# EAGLE design pwr_block (EAGLE 6.5.0)
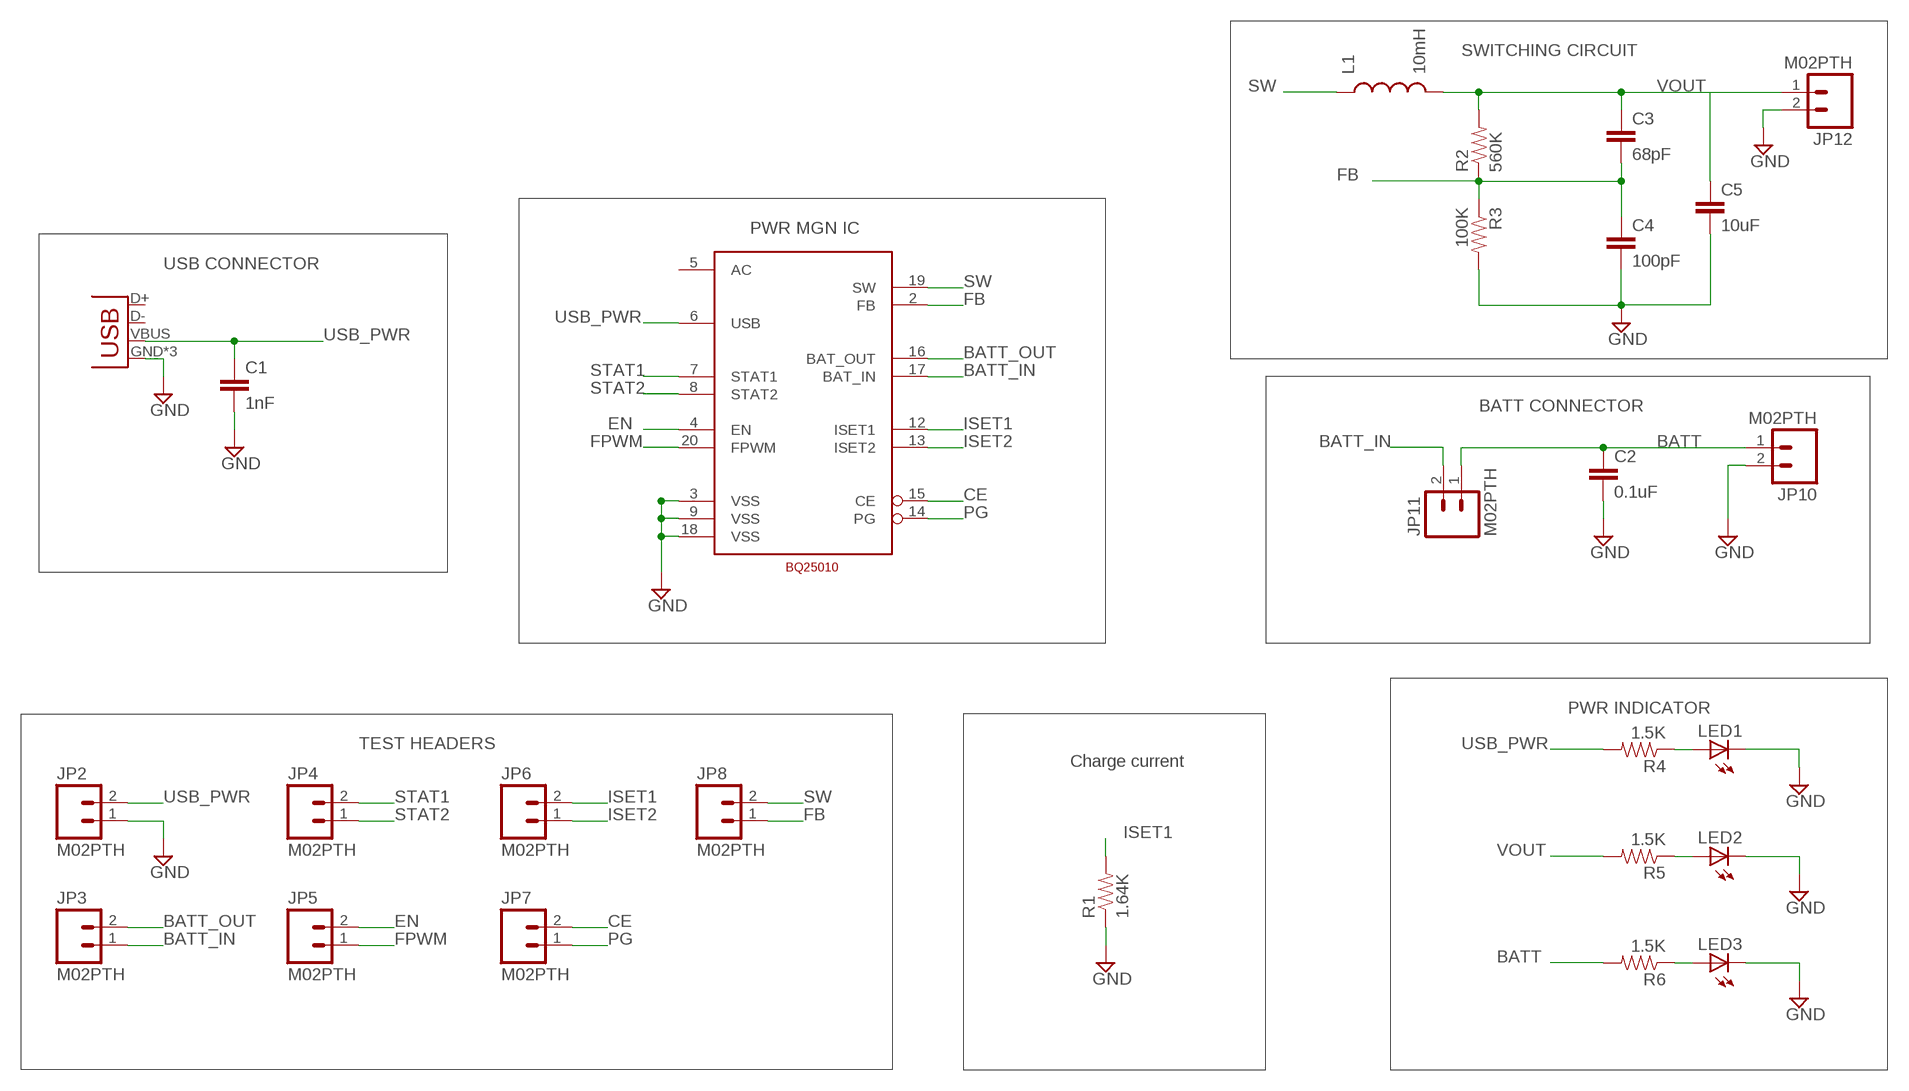
[diagram p0: schematic, sheet 1]

## Parts
C1  1nF  1NF/1000PF-50V-10%(0603)  [0603-CAP]
C2  0.1uF  0.1UF-100V-10%(0603)  [0603-CAP]
C3  68pF  10UF-6.3V-20%(0603)  [0603-CAP]
C4  100pF  10UF-6.3V-20%(0603)  [0603-CAP]
C5  10uF  10UF-6.3V-20%(0603)  [0603-CAP]
JP1  USB-MICROB  [USB-MICROB]
JP2  M02PTH  [1X02]
JP3  M02PTH  [1X02]
JP4  M02PTH  [1X02]
JP5  M02PTH  [1X02]
JP6  M02PTH  [1X02]
JP7  M02PTH  [1X02]
JP8  M02PTH  [1X02]
JP10  M02PTH  [1X02]
JP11  M02PTH  [1X02]
JP12  M02PTH  [1X02]
L1  10mH  INDUCTOR0603  [0603]
LED1  LED0603  [LED-0603]
LED2  LED0603  [LED-0603]
LED3  LED0603  [LED-0603]
R1  1.64K  RESISTOR0603-RES  [0603-RES]
R2  560K  RESISTOR0603-RES  [0603-RES]
R3  100K  RESISTOR0603-RES  [0603-RES]
R4  1.5K  RESISTOR0603-RES  [0603-RES]
R5  1.5K  RESISTOR0603-RES  [0603-RES]
R6  1.5K  RESISTOR0603-RES  [0603-RES]
U$1  BQ25010  [VQFN_RHL_20PIN]

## Nets
BATT: C2.1 JP10.1 JP11.1 R6.2
BATT_IN: JP3.1 JP11.2 U$1.17(BAT_IN)
BATT_OUT: JP3.2 U$1.16(BAT_OUT)
CE: JP7.2 U$1.15(CE)
EN: JP5.2 U$1.4(EN)
FB: C3.2 C4.1 JP8.1 R2.1 R3.1 U$1.2(FB)
FPWM: JP5.1 U$1.20(FPWM)
GND: C1.2 C2.2 C4.2 C5.2 JP1.GND JP1.MT1(GND) JP1.MT2(GND) JP2.1 JP10.2 JP12.2 LED1.C LED2.C LED3.C R1.1 R3.2 U$1.3(VSS) U$1.9(VSS) U$1.18(VSS)
ISET1: JP6.2 R1.2 U$1.12(ISET1)
ISET2: JP6.1 U$1.13(ISET2)
N$1: LED1.A R4.1
N$2: LED2.A R5.1
N$3: LED3.A R6.1
PG: JP7.1 U$1.14(PG)
STAT1: JP4.2 U$1.7(STAT1)
STAT2: JP4.1 U$1.8(STAT2)
SW: JP8.2 L1.1 U$1.19(SW)
USB_PWR: C1.1 JP1.VBUS JP2.2 R4.2 U$1.6(USB)
VOUT: C3.1 C5.1 JP12.1 L1.2 R2.2 R5.2
Unconnected: JP1.D+ JP1.D- U$1.5(AC)

## Notes on the sheet
- SWITCHING CIRCUIT
- PWR MGN IC
- USB CONNECTOR
- BATT CONNECTOR
- PWR INDICATOR
- TEST HEADERS
- Charge current

## Library data of the parts
C1 = SparkFun-Capacitors:1NF/1000PF-50V-10%(0603): CAP-07886; PROD_ID: CAP-07886
C2 = SparkFun-Capacitors:0.1UF-100V-10%(0603): CAP-08390; PROD_ID: CAP-08390
C3 C4 = SparkFun-Capacitors:10UF-6.3V-20%(0603): CAP-11015; PROD_ID: CAP-11015; VALUE: 10uF
C5 = SparkFun-Capacitors:10UF-6.3V-20%(0603): CAP-11015; PROD_ID: CAP-11015
JP1 = SparkFun-Connectors:USB: USB Connectors USB-B-PTH is fully proven SKU : PRT-00139/CONN-08278 USB-miniB is fully proven SKU : PRT-00587 USB-A-PCB is untested. USB-A-H is throughly reviewed, but untested. Spark Fun Electronics SKU : PRT-00437 USB-B-SMT is throughly reviewed, but untested. Needs silkscreen touching up. USB-A-S has not been used/tested USB-MB-H has not been used/tested USB-MICROB has been used. CONN-09505; DESCRIPTION: CONN RCPT STD MICRO USB TYPE B; PROD_ID: CONN-09505
JP2-JP8 JP10-JP12 = SparkFun-Connectors:M02: Standard 2-pin 0.1" header. Use with - straight break away headers ( PRT-00116) - right angle break away headers (PRT-00553) - swiss pins (PRT-00743) - machine pins (PRT-00117) - female headers (PRT-00115) Molex polarized connector foot print use with: PRT-08233 with associated crimp pins and housings. 2.54_SCREWTERM for use with PRT-10571. 3.5mm Screw Terminal footprints for PRT-08084 5mm Screw Terminal footprints for use with PRT-08433
L1 = SparkFun-Passives:INDUCTOR: Inductors Basic Inductor/Choke - 0603 and 1206. Footprints are not proven and vary greatly between part numbers. SRN6045- 33uH, 20% 1.4A SDR0403-560KL - 56uH, 10%, 500mA RMS/740mA peak
LED1-LED3 = SparkFun-LED:LED: LEDs Standard schematic elements and footprints for 5mm, 3mm, 1206, and 0603 sized LEDs. 5mm - Spark Fun Electronics SKU : COM-00529 (and others)
R1-R6 = SparkFun-Passives:RESISTOR: Resistor Basic schematic elements and footprints for 0603, 1206, and PTH resistors.
U$1 = TuansLib:BQ25010

## Board
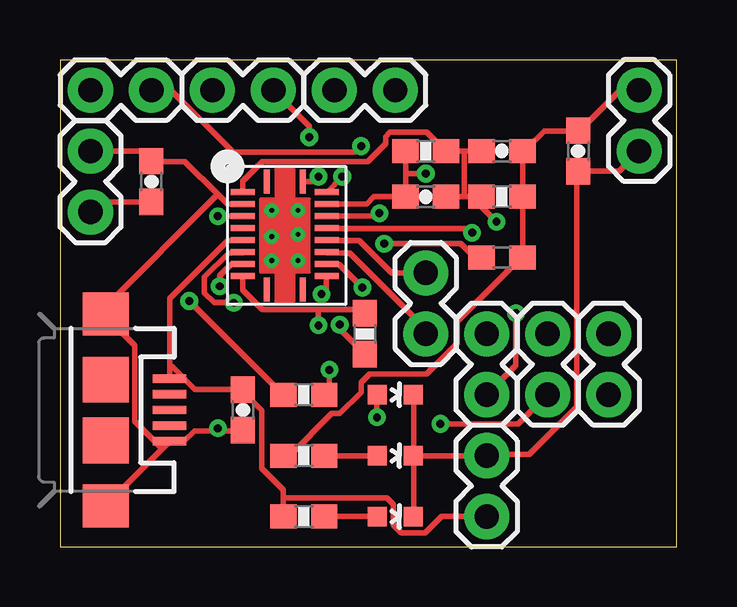
[diagram p1: board, top side]
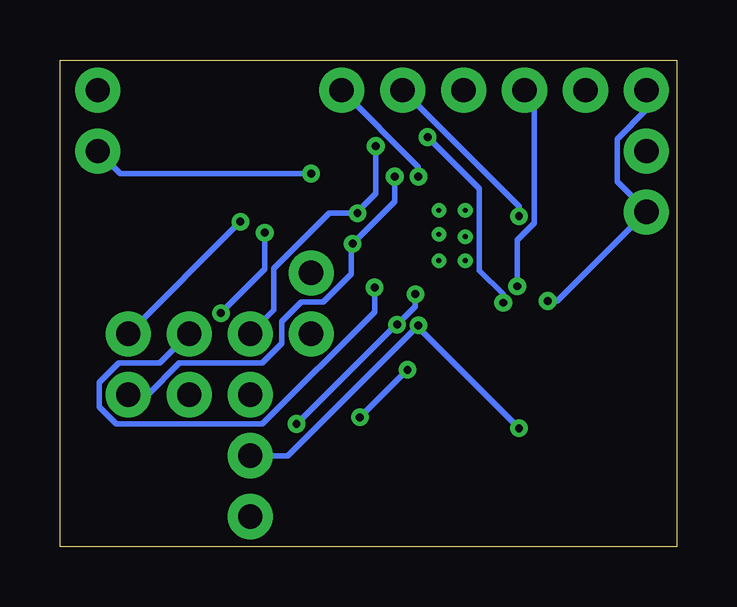
[diagram p2: board, bottom side, seen from below]

Size 25.7 x 20.31 mm. Coordinates in mm from the lower left corner, seen from the top.
Outline: 0,0 25.7,0 25.7,20.31 0,20.31 0,0
Copper layers (1*16): Top 0.035mm / dielectric 1.5mm / Bottom 0.035mm
Design rules "default *": minimum track width 9mil, minimum drill 13mil, track to track 6mil, track to pad 6mil, pad to pad 6mil, via to via 6mil, smd to smd 6mil, copper to edge 15mil, drill to drill 15mil, minimum pad ring 8mil, minimum via ring 8mil, stop-mask expansion 3mil, vias tented up to drill 0mil, thermal gap 10mil

### Footprints (pad centres in the part's own frame; a part is rotated, then mirrored left to right if it is on the bottom)
0603-CAP = smd 1.1 x 1: 1 -0.85,0; 2 0.85,0
USB-MICROB = smd 0.35 x 1.4: D+ 0,2.65; D- -0.65,2.65; GND 1.3,2.65; ID 0.65,2.65; VBUS -1.3,2.65 | smd 1.8 x 1.9: MT1 -4,0; MT2 4,0 | smd 1.9 x 1.9: P$1 -1.27,0; P$2 1.27,0
1X02 = drill 1.016 pad 1.88: 1 0,0; 2 2.54,0
0603 = smd 1.1 x 1: 1 -0.85,0; 2 0.85,0
LED-0603 = smd 0.8 x 0.8: A 0,-0.75; C 0,0.75
0603-RES = smd 1.1 x 1: 1 -0.85,0; 2 0.85,0
VQFN_RHL_20PIN = smd 1 x 0.25: 1 0,1; 10 4.5,1; 11 4.5,2.5; 20 0,2.5 | smd 0.25 x 1: 2 0.45,0; 3 0.95,0; 4 1.45,0; 5 1.95,0; 6 2.45,0; 7 2.95,0; 8 3.45,0; 9 3.95,0; 12 3.95,3.5; 13 3.45,3.5; 14 2.95,3.5; 15 2.45,3.5; 16 1.95,3.5; 17 1.45,3.5; 18 0.95,3.5; 19 0.45,3.5 | drill 0.2: P$21 1.2,2.3; P$22 1.2,1.2; P$23 2.3,1.2; P$24 2.2,2.3; P$25 3.3,2.3; P$26 3.3,1.2

### Placement (x,y rotation side)
C1  7.62,5.71 270 top
C2  3.81,15.24 90 top
C3  18.41,16.51 180 top
C4  15.24,14.61 180 top
C5  21.59,16.51 270 top
JP1  1.91,5.71 270 top
JP2  17.78,3.81 270 top
JP3  17.78,8.89 270 top
JP4  6.35,19.05 0 top
JP5  13.97,19.05 180 top
JP6  20.32,8.89 270 top
JP7  15.24,8.89 90 top
JP8  22.86,8.89 270 top
JP10  1.27,13.97 90 top
JP11  1.27,19.05 0 top
JP12  24.13,19.05 270 top
L1  18.41,12.06 0 top
LED1  13.97,1.27 270 top
LED2  13.97,3.81 270 top
LED3  13.97,6.35 270 top
R1  12.7,8.89 270 top
R2  18.41,14.61 0 top
R3  15.24,16.51 180 top
R4  10.16,1.27 180 top
R5  10.16,3.81 180 top
R6  10.16,6.35 180 top
U$1  7.62,15.24 270 top

### Tracks (layer width: path | path; a pad name or v marks a point on that pad's centre or on a via)
BATT  (via drill 0.33)
  Top 0.229: JP10.1 1.68,14.38 3.81,14.38 C2.1 | v5.38,10.26 9.3,6.35 R6.2
  Bottom 0.229: v5.38,10.26 4.98,10.26 JP10.1 1.32,14.07 2.49,15.24 2.49,17.02 1.27,18.24 JP11.1
BATT_IN  (via drill 0.33)
  Top 0.229: v13.31,13.92 13.18,13.79 U$1.17 | JP11.2 4.62,19.05 7.21,16.46 12.29,16.46 v12.55,16.71
  Bottom 0.229: JP3.1 16.79,9.88 16.79,11.61 14.48,13.92 v13.31,13.92 13.26,14.02 12.55,14.73 v12.55,16.71
BATT_OUT  (via drill 0.33)
  Top 0.229: v17.17,13.11 16.99,13.28 U$1.16 | v19,9.75 19,7.57 JP3.2
  Bottom 0.229: v17.17,13.11 17.17,11.58 v19,9.75
CE
  Top 0.229: JP7.2 13.82,11.43 12.47,12.78 11.12,12.78 U$1.15
EN  (via drill 0.33)
  Top 0.229: v6.58,13.79 U$1.4
  Bottom 0.229: v6.58,13.79 6.58,14.2 JP5.2
FB  (via drill 0.33)
  Top 0.229: 16.84,14.61 R2.1 17.25,14.5 v18.19,13.56 | 16.84,14.61 C4.1 | U$1.2 7.62,15.27 8.43,16.08 12.83,16.08 13.56,16.82 13.56,17.12 13.74,17.3 15.29,17.3 16.08,16.51 R3.1 16.84,16.51 | 16.84,16.51 C3.2 | 16.84,16.51 16.84,14.61
  Bottom 0.229: v18.19,13.56 JP8.1
FPWM  (via drill 0.33)
  Top 0.229: U$1.20 10.57,15.24 v10.77,15.44
  Bottom 0.229: v10.77,15.44 10.77,15.85 JP5.1
GND  (via drill 0.33)
  Top 0.229: 6.58,4.85 5.61,4.85 5.18,4.42 4.57,4.42 JP1.GND 4.5,4.32 4.27,4.09 | 6.58,4.85 7.62,4.85 C1.2 | 4.27,4.09 1.91,1.73 JP1.MT2 | 6.58,14.71 5.21,16.08 3.81,16.08 C2.2 3.71,16.13 3.33,16.51 JP10.2 | 6.58,14.71 6.99,14.3 U$1.3 | 6.58,14.71 1.91,10.03 JP1.MT1 1.93,9.6 3.12,8.41 3.12,5.23 4.27,4.09 | U$1.18 12.78,14.3 13.08,14.61 C4.2 14.4,14.71 14.4,15.57 | 14.4,15.57 14.4,16.51 R3.2 | JP12.2 23.29,15.67 21.59,15.67 C5.2 21.54,15.57 21.54,5.84 19.56,3.86 17.88,3.86 JP2.1 LED2.C | v15.24,15.57 14.4,15.57 | U$1.9 7.62,10.72 8.43,9.91 10.77,9.91 | 10.77,9.91 12.55,9.91 12.7,9.75 R1.1 | LED1.C 14.73,1.27 14.73,3.81 LED2.C | LED3.C 14.73,6.35 14.73,3.91 LED2.C | v10.77,9.25 10.77,9.91 | v6.58,4.95 6.58,4.85
  Bottom 0.229: v15.24,15.57 23.19,15.57 JP12.2 | JP2.1 16.2,3.81 v10.77,9.25 10.74,9.12 v6.58,4.95
ISET1  (via drill 0.33)
  Top 0.229: v10.9,10.54 11.1,10.74 11.1,11.28 U$1.12 | v11.66,9.27 11.66,9.09 12.7,8.05 R1.2 | v15.85,5.13 19.1,5.13 JP6.2
  Bottom 0.229: v10.9,10.54 10.9,10.03 v11.66,9.27 11.76,9.22 v15.85,5.13
ISET2  (via drill 0.33)
  Top 0.229: v12.6,10.82 11.63,11.79 U$1.13
  Bottom 0.229: v12.6,10.82 12.6,9.8 17.27,5.13 23.37,5.13 24.08,5.84 24.08,6.86 23.27,7.67 21.54,7.67 JP6.1
N$1
  Top 0.229: R4.1 LED1.A
N$2
  Top 0.229: R5.1 LED2.A
N$3  (via drill 0.33)
  Top 0.229: v13.21,5.41 13.21,6.35 LED3.A | v11.23,7.39 11.23,6.55 11.02,6.35 R6.1
  Bottom 0.229: v11.23,7.39 v13.21,5.41
PG
  Top 0.229: JP7.1 15.24,9.09 12.06,12.27 11.12,12.27 U$1.14
STAT1  (via drill 0.33)
  Top 0.229: v7.24,10.19 6.43,10.19 6.02,10.59 6.02,11.25 7.04,12.27 7.62,12.27 U$1.7 | v10.39,17.09 10.39,17.55 JP4.2
  Bottom 0.229: v7.24,10.19 7.24,10.54 8.23,11.53 8.23,14.94 v10.39,17.09
STAT2  (via drill 0.33)
  Top 0.229: v6.66,10.87 6.66,11.33 7.11,11.79 U$1.8
  Bottom 0.229: v6.66,10.87 6.66,12.8 5.94,13.51 5.94,18.64 JP4.1
SW  (via drill 0.33)
  Top 0.229: v11.76,15.44 11.12,14.81 U$1.19 | v13.51,12.65 16.69,12.65 17.27,12.06 L1.1
  Bottom 0.229: v11.76,15.44 11.76,14.4 v13.51,12.65 13.56,12.55 13.56,11.38 14.73,10.21 15.65,10.21 16.46,9.4 16.46,8.48 17.27,7.67 20.73,7.67 22.05,6.35 JP8.2
USB_PWR
  Top 0.229: 4.57,7.52 4.57,7.04 JP1.VBUS | 4.57,7.52 4.57,10.36 6.99,12.78 7.62,12.78 U$1.6 | 4.57,7.52 4.67,7.52 5.61,6.58 7.62,6.58 C1.1 7.64,6.45 8.41,5.69 8.41,3.28 9.3,2.39 9.3,2.06 | 9.3,2.06 9.3,1.27 R4.2 | JP2.2 15.9,1.27 15.21,0.58 14.22,0.58 13.89,0.91 13.89,1.78 13.61,2.06 9.3,2.06
VOUT
  Top 0.229: R5.2 9.58,3.81 11.33,5.56 11.66,5.56 12.55,6.45 12.55,6.86 12.9,7.21 15.29,7.21 16.56,8.48 16.56,9.4 19.23,12.06 L1.2 19.28,12.17 19.28,14.5 R2.2 C3.1 19.38,16.56 20.17,17.35 21.59,17.35 C5.1 21.69,17.4 23.34,19.05 JP12.1